# EAGLE design neopixel_studio_light (EAGLE 9.6.2)
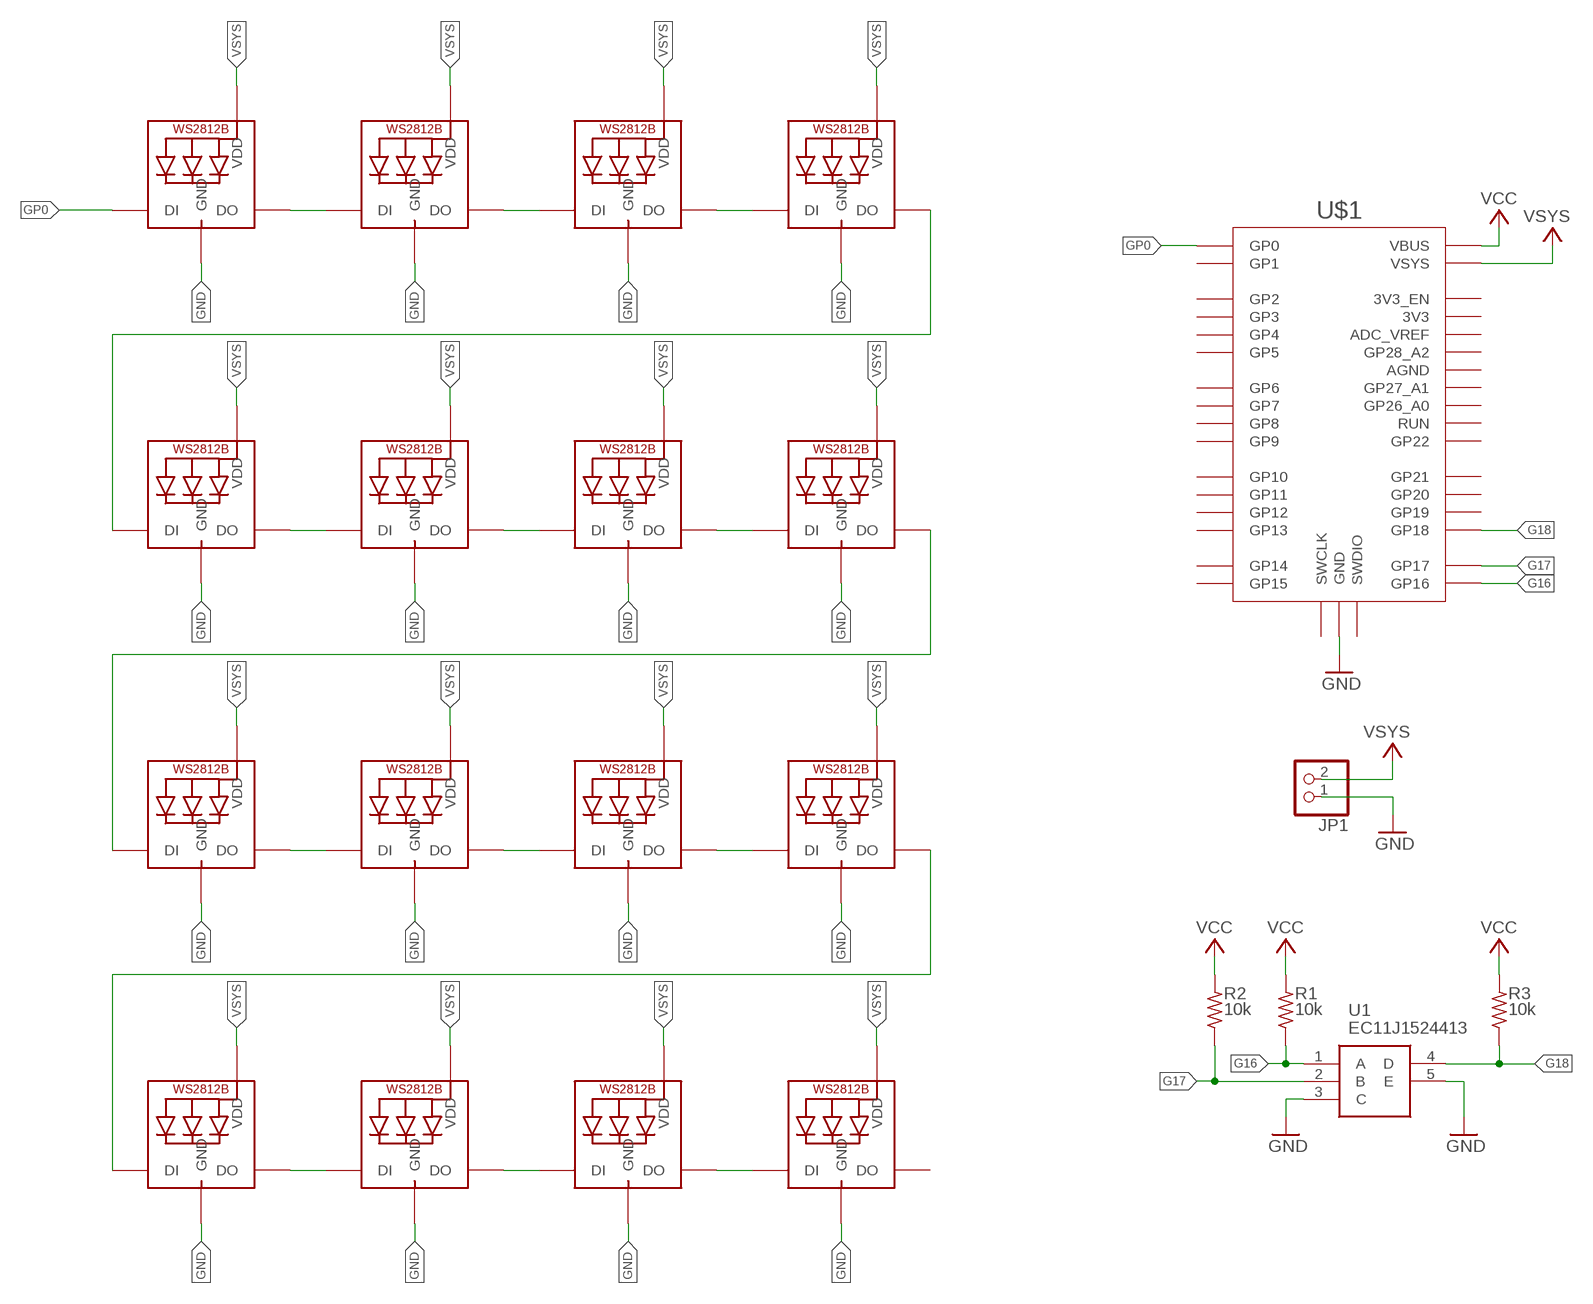
[diagram p0: schematic, sheet 1]

## Parts
JP1  PINHD-1X2  [1X02]
LED1  WS2812B5050  [WS2812B]
LED2  WS2812B5050  [WS2812B]
LED3  WS2812B5050  [WS2812B]
LED4  WS2812B5050  [WS2812B]
LED5  WS2812B5050  [WS2812B]
LED6  WS2812B5050  [WS2812B]
LED7  WS2812B5050  [WS2812B]
LED8  WS2812B5050  [WS2812B]
LED9  WS2812B5050  [WS2812B]
LED10  WS2812B5050  [WS2812B]
LED11  WS2812B5050  [WS2812B]
LED12  WS2812B5050  [WS2812B]
LED13  WS2812B5050  [WS2812B]
LED14  WS2812B5050  [WS2812B]
LED15  WS2812B5050  [WS2812B]
LED16  WS2812B5050  [WS2812B]
R1  10k  R-US_R0603  [R0603]
R2  10k  R-US_R0603  [R0603]
R3  10k  R-US_R0603  [R0603]
U1  EC11J1524413  [EC11J1524413]
U$1  RPI_PICO-SMD  [RPI_PICO]

## Nets
G16: R1.1 U1.1(A) U$1.GP16
G17: R2.1 U1.2(B) U$1.GP17
G18: R3.1 U1.4(D) U$1.GP18
GND [5V]: JP1.1 LED1.3-GND(GND) LED2.3-GND(GND) LED3.3-GND(GND) LED4.3-GND(GND) LED5.3-GND(GND) LED6.3-GND(GND) LED7.3-GND(GND) LED8.3-GND(GND) LED9.3-GND(GND) LED10.3-GND(GND) LED11.3-GND(GND) LED12.3-GND(GND) LED13.3-GND(GND) LED14.3-GND(GND) LED15.3-GND(GND) LED16.3-GND(GND) U1.3(C) U1.5(E) U$1.GND@1(GND) U$1.GND@2(GND) U$1.GND@3(GND) U$1.GND@4(GND) U$1.GND@5(GND) U$1.GND@6(GND) U$1.GND@7(GND) U$1.GND@8(GND)
GP0: LED1.4-DIN(DI) U$1.GP0
N$3: LED1.2-DOUT(DO) LED2.4-DIN(DI)
N$4: LED2.2-DOUT(DO) LED3.4-DIN(DI)
N$5: LED3.2-DOUT(DO) LED4.4-DIN(DI)
N$6: LED4.2-DOUT(DO) LED5.4-DIN(DI)
N$7: LED5.2-DOUT(DO) LED6.4-DIN(DI)
N$8: LED6.2-DOUT(DO) LED7.4-DIN(DI)
N$9: LED7.2-DOUT(DO) LED8.4-DIN(DI)
N$10: LED8.2-DOUT(DO) LED9.4-DIN(DI)
N$11: LED12.2-DOUT(DO) LED13.4-DIN(DI)
N$12: LED13.2-DOUT(DO) LED14.4-DIN(DI)
N$13: LED14.2-DOUT(DO) LED15.4-DIN(DI)
N$14: LED15.2-DOUT(DO) LED16.4-DIN(DI)
N$16: LED9.2-DOUT(DO) LED10.4-DIN(DI)
N$21: LED10.2-DOUT(DO) LED11.4-DIN(DI)
N$22: LED11.2-DOUT(DO) LED12.4-DIN(DI)
VCC [5V]: R1.2 R2.2 R3.2 U$1.VBUS
VSYS [5V]: JP1.2 LED1.1-VDD(VDD) LED2.1-VDD(VDD) LED3.1-VDD(VDD) LED4.1-VDD(VDD) LED5.1-VDD(VDD) LED6.1-VDD(VDD) LED7.1-VDD(VDD) LED8.1-VDD(VDD) LED9.1-VDD(VDD) LED10.1-VDD(VDD) LED11.1-VDD(VDD) LED12.1-VDD(VDD) LED13.1-VDD(VDD) LED14.1-VDD(VDD) LED15.1-VDD(VDD) LED16.1-VDD(VDD) U$1.VSYS
Unconnected: LED16.2-DOUT(DO) U$1.3V3 U$1.3V3_EN U$1.ADC_VREF U$1.AGND U$1.GP1 U$1.GP2 U$1.GP3 U$1.GP4 U$1.GP5 U$1.GP6 U$1.GP7 U$1.GP8 U$1.GP9 U$1.GP10 U$1.GP11 U$1.GP12 U$1.GP13 U$1.GP14 U$1.GP15 U$1.GP19 U$1.GP20 U$1.GP21 U$1.GP22 U$1.GP26_A0 U$1.GP27_A1 U$1.GP28_A2 U$1.RUN U$1.SWCLK U$1.SWDIO

## Library data of the parts
JP1 = pinhead2:PINHD-1X2: PIN HEADER
LED1-LED16 = adafruit:WS2812B
R1-R3 = rcl:R-US_: RESISTOR, American symbol; SPICEPREFIX: R
U1 = EC11J1524413:EC11J1524413: 20mm Vertical encoder 15 Pulses 30 DET Alps 15 Pulse Incremental Mechanical Rotary Encoder with a 5.975 mm Flat Shaft (Not Indexed), SMD Source: Datasheet; DESCRIPTION: 20mm Vertical encoder 15 Pulses 30 DET Alps 15 Pulse Incremental Mechanical Rotary Encoder with a 5.975 mm Flat Shaft (Not Indexed), SMD; HEIGHT: mm; MANUFACTURER_NAME: ALPS; MANUFACTURER_PART_NUMBER: EC11J1524413
U$1 = RaspberryPi_Pico:RPI_PICO

## Net classes
0 default: width 0.5 mm
1 5V: width 0.75 mm

## Board
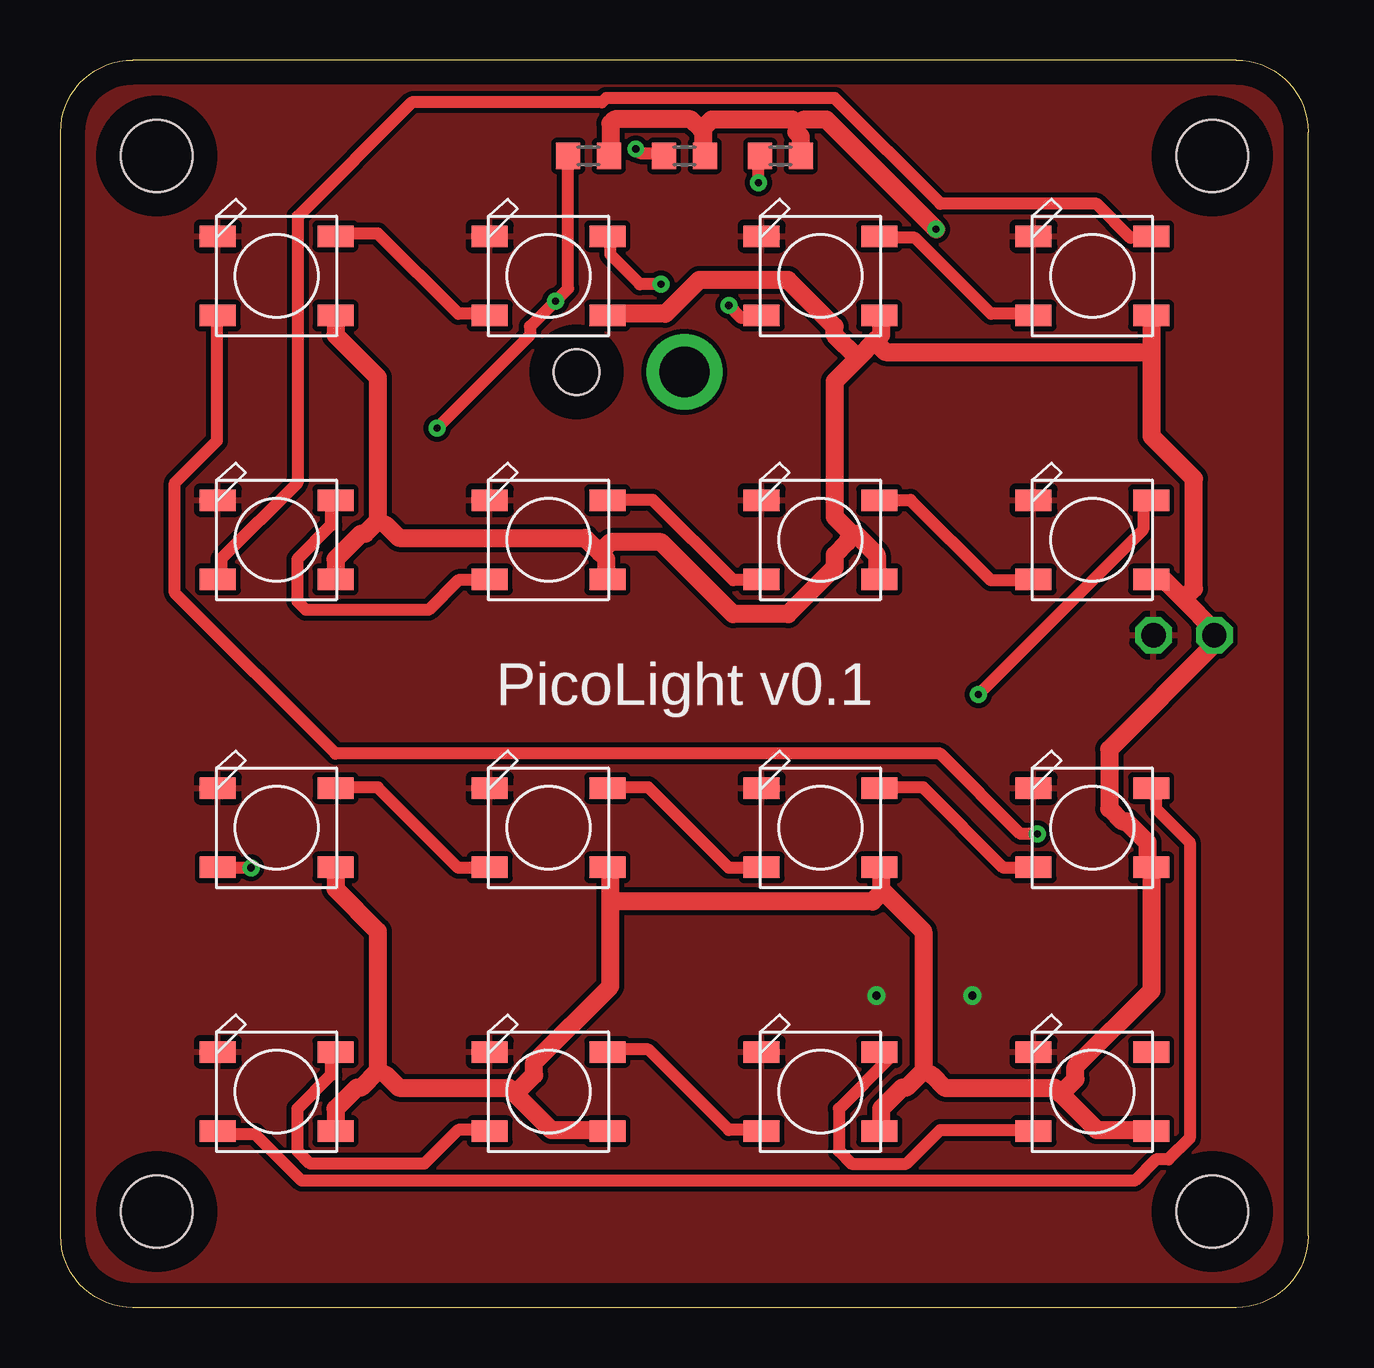
[diagram p1: board, top side]
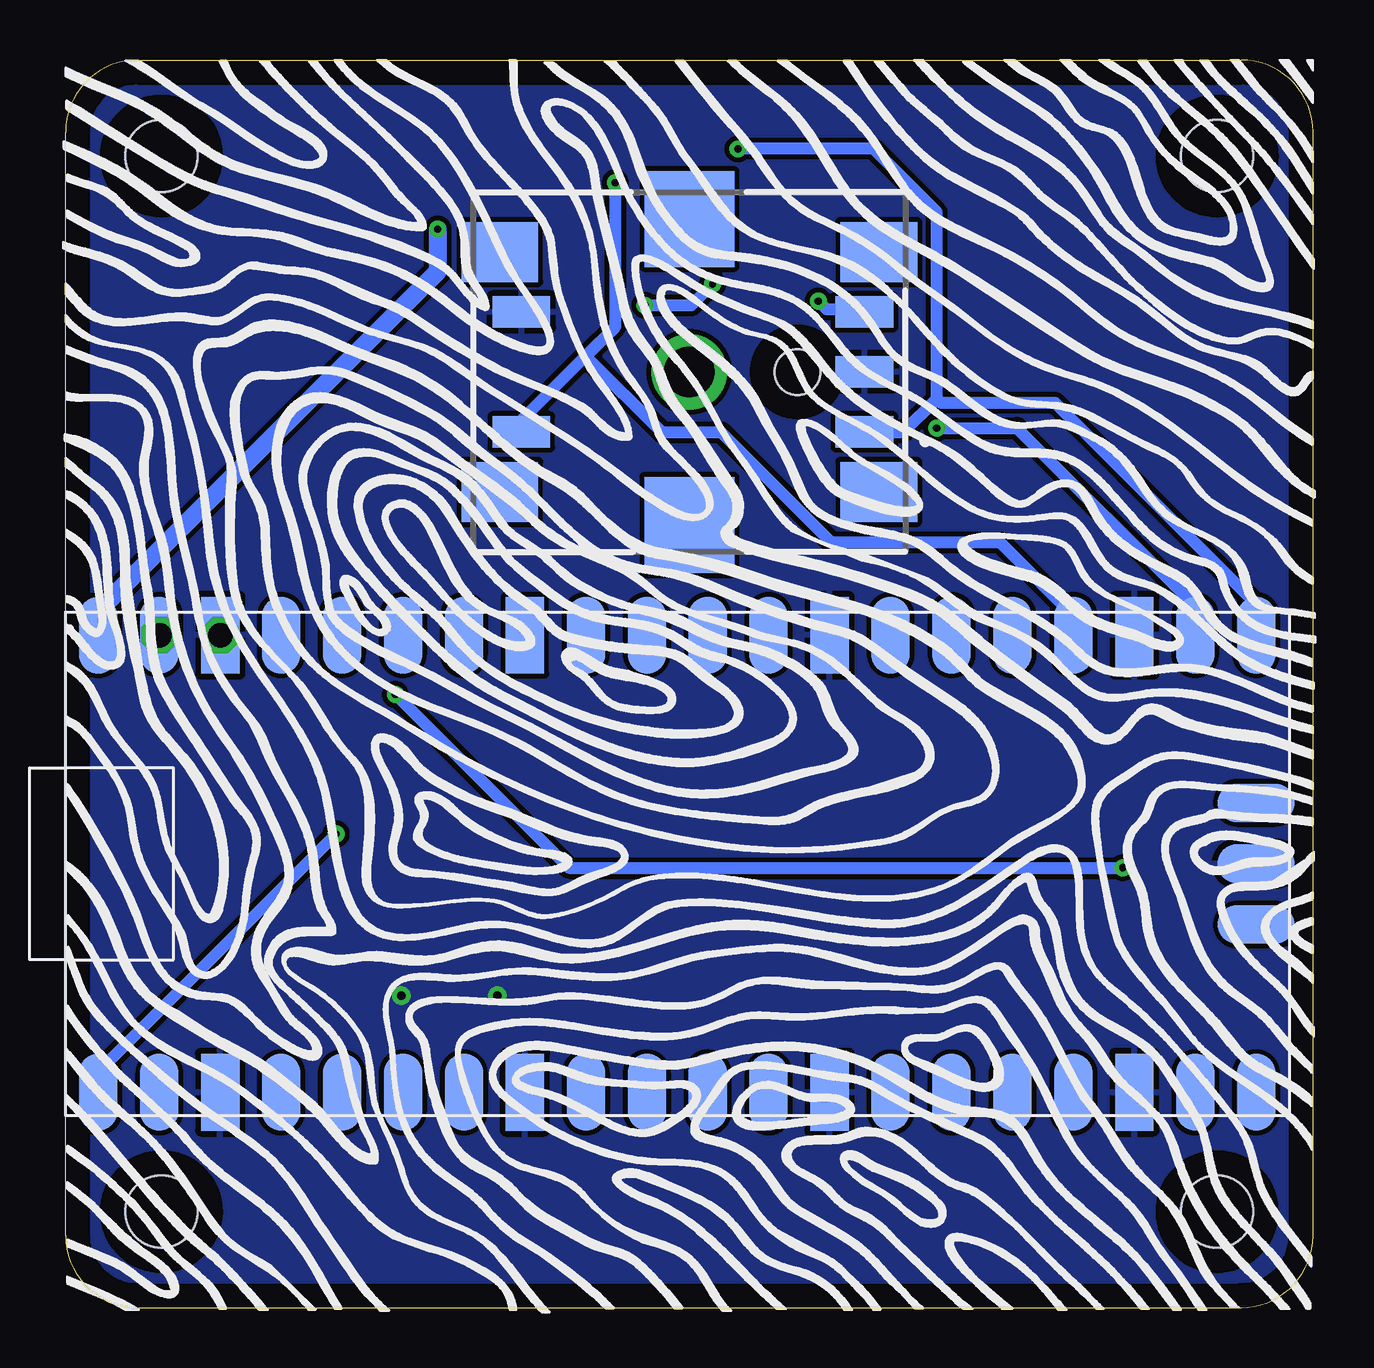
[diagram p2: board, bottom side, seen from below]

Size 52 x 52 mm. Coordinates in mm from the lower left corner, seen from the top.
Outline: 49,0 3,0 arc-90 0,3 0,49 arc-90 3,52 49,52 arc-90 52,49 52,3 arc-90 49,0
Copper layers (1*16): Top 0.035mm / dielectric 1.5mm / Bottom 0.035mm
Design rules "PCBway": minimum track width 6mil, minimum drill 0.3mm, track to track 0.205mm, track to pad 0.205mm, pad to pad 0.205mm, via to via 0.205mm, smd to smd 8mil, copper to edge 40mil, drill to drill 8mil, minimum pad ring 10mil, minimum via ring 8mil, stop-mask expansion 4mil, vias tented up to drill 25mil, thermal gap 10mil
Holes 3 mm at 4,4 4,48 48,48 48,4
bRestrict: area 1.5,45.5 to 6.5,50.5; area 45.5,45.5 to 50.5,50.5; area 45.5,1.5 to 50.5,6.5; area 1.5,1.5 to 6.5,6.5

### Footprints (pad centres in the part's own frame; a part is rotated, then mirrored left to right if it is on the bottom)
1X02 = drill 1.016 octagon: 1 -1.27,0; 2 1.27,0
WS2812B = smd 1.5 x 0.9: 1-VDD 2.45,-1.65; 2-DOUT 2.45,1.65; 3-GND -2.45,1.65; 4-DIN -2.45,-1.65
R0603 = smd 1 x 1.1: 1 -0.85,0; 2 0.85,0
EC11J1524413 = smd 1.3 x 2.4: 1 -2.5,-7.3; 2 2.5,-7.3; 3 0,-7.3; 4 -2.5,7; 5 2.5,7 | smd 2.5 x 3.2: 6 5,7.9; 8 5,-7.9; 9 -5,-7.9; 11 -5,7.9 | smd 4 x 3.75: 7 6.375,0; 10 -6.375,0 | drill 2.1 pad 3.15: 12 0,0 | hole 1.9: 0,-4.5
RPI_PICO = smd 3.2 x 1.6: 3V3 9.525,13.97; 3V3_EN 9.525,16.51; ADC_VREF 9.525,11.43; AGND 9.525,6.35; GND@1 -9.525,19.05; GND@2 -9.525,6.35; GND@3 -9.525,-6.35; GND@4 -9.525,-19.05; GND@6 9.525,-19.05; GND@7 9.525,-6.35; GND@8 9.525,19.05; GP0 -9.525,24.13; GP1 -9.525,21.59; GP2 -9.525,16.51; GP3 -9.525,13.97; GP4 -9.525,11.43; GP5 -9.525,8.89; GP6 -9.525,3.81; GP7 -9.525,1.27; GP8 -9.525,-1.27; GP9 -9.525,-3.81; GP10 -9.525,-8.89; GP11 -9.525,-11.43; GP12 -9.525,-13.97; GP13 -9.525,-16.51; GP14 -9.525,-21.59; GP15 -9.525,-24.13; GP16 9.525,-24.13; GP17 9.525,-21.59; GP18 9.525,-16.51; GP19 9.525,-13.97; GP20 9.525,-11.43; GP21 9.525,-8.89; GP22 9.525,-3.81; GP26_A0 9.525,1.27; GP27_A1 9.525,3.81; GP28_A2 9.525,8.89; RUN 9.525,-1.27; VBUS 9.525,24.13; VSYS 9.525,21.59 | smd 1.6 x 3.2: GND@5 0,-24.13; SWCLK -2.54,-24.13; SWDIO 2.54,-24.13

### Placement (x,y rotation side)
JP1  46.82,28.03 0 top
LED1  9,43 0 top
LED2  20.33,43 0 top
LED3  31.67,43 0 top
LED4  43,43 0 top
LED5  9,32 0 top
LED6  20.33,32 0 top
LED7  31.67,32 0 top
LED8  43,32 0 top
LED9  9,20 0 top
LED10  20.33,20 0 top
LED11  31.67,20 0 top
LED12  43,20 0 top
LED13  9,9 0 top
LED14  20.33,9 0 top
LED15  31.67,9 0 top
LED16  43,9 0 top
R1  26,48 0 top
R2  22,48 0 top
R3  30,48 0 top
U1  26,39 90 bottom
U$1  26.5,18.5 90 bottom

### Tracks (layer width: path | path; a pad name or v marks a point on that pad's centre or on a via)
G16  (via drill 0.3)
  Top 0.5: v23.97,48.29 24.15,48.12 25.03,48.12 R1.1
  Bottom 0.5: v23.97,48.29 18.33,48.29 15.69,45.65 15.69,37.89 | 15.69,37.89 17.1,36.48 18.68,36.48 U1.1 | U$1.GP16 2.47,28.2 2.47,29.43 10.75,37.72 15.51,37.72 15.69,37.89
G17  (via drill 0.3)
  Top 0.5: R2.1 21.15,42.48 v20.62,41.95 19.56,40.89 19.56,40.54 v15.69,36.66
  Bottom 0.5: v20.62,41.95 20.27,41.59 18.86,41.59 U1.2 | v15.69,36.66 12.34,36.66 4.93,29.26 4.93,28.2 U$1.GP17
G18  (via drill 0.3)
  Top 0.5: v29.08,46.88 29.08,47.94 R3.1
  Bottom 0.5: v29.08,46.88 29.08,40.89 30.32,39.66 | 30.32,39.66 32.96,37.01 32.96,36.66 U1.4 | 30.32,39.66 27.14,36.48 24.68,36.48 20.09,31.9 13.04,31.9 10.05,28.91 10.05,28.2 U$1.GP18
GND  (via drill 0.35)
  other vias: 34,13 38,13
  pour Top: 0,0 52,0 52,0.5 52,52 0,52
  pour Bottom: 0,0 52,0 52,52 0,52
GP0  (via drill 0.3)
  Top 0.5: v40.71,19.74 40.01,19.74 36.66,23.09 11.46,23.09 4.76,29.79 4.76,34.37 6.52,36.13 6.52,41.24 LED1.4-DIN
  Bottom 0.5: v40.71,19.74 50.58,9.87 50.58,8.99 U$1.GP0
N$3
  Top 0.5: LED1.2-DOUT 11.46,44.77 13.22,44.77 16.57,41.42 17.8,41.42 LED2.4-DIN
N$4  (via drill 0.3)
  Top 0.5: v25.03,42.65 24.15,42.65 22.91,43.89 22.91,44.59 LED2.2-DOUT | v27.85,41.77 28.38,41.24 29.08,41.24 LED3.4-DIN
  Bottom 0.5: v25.03,42.65 25.91,41.77 v27.85,41.77
N$5
  Top 0.5: LED3.2-DOUT 34.19,44.59 35.6,44.59 38.77,41.42 40.54,41.42 LED4.4-DIN
N$6
  Top 0.5: LED5.4-DIN 6.7,30.49 6.7,31.2 9.87,34.37 9.87,45.47 14.63,50.23 22.56,50.23 22.74,50.41 32.25,50.41 36.66,46 43.18,46 44.59,44.59 45.3,44.59 LED4.2-DOUT
N$7
  Top 0.5: LED5.2-DOUT 11.28,33.49 11.28,32.61 9.87,31.2 9.87,29.43 10.22,29.08 15.33,29.08 16.57,30.32 17.8,30.32 LED6.4-DIN
N$8
  Top 0.5: LED6.2-DOUT 22.91,33.66 24.68,33.66 28.02,30.32 29.08,30.32 LED7.4-DIN
N$9
  Top 0.5: LED8.4-DIN 40.54,30.32 38.77,30.32 35.43,33.66 34.19,33.66 LED7.2-DOUT
N$10  (via drill 0.3)
  Top 0.5: v7.93,18.33 6.7,18.33 LED9.4-DIN | v38.25,25.56 45.12,32.43 45.12,33.49 45.3,33.66 LED8.2-DOUT
  Bottom 0.5: v7.93,18.33 31.02,18.33 v38.25,25.56
N$11
  Top 0.5: LED13.4-DIN 6.7,7.23 8.11,7.23 10.05,5.29 44.77,5.29 45.65,6.17 46.18,6.17 47.06,7.05 47.06,19.39 45.65,20.8 45.65,21.5 45.47,21.68 LED12.2-DOUT
N$12
  Top 0.5: LED13.2-DOUT 11.28,10.57 11.28,9.69 9.87,8.28 9.87,6.52 10.4,5.99 15.16,5.99 16.57,7.4 17.8,7.4 LED14.4-DIN
N$13
  Top 0.5: LED14.2-DOUT 22.91,10.75 24.5,10.75 27.85,7.4 29.08,7.4 LED15.4-DIN
N$14
  Top 0.5: LED16.4-DIN 40.54,7.4 36.66,7.4 35.25,5.99 32.96,5.99 32.43,6.52 32.43,8.28 34.55,10.4 34.19,10.75 LED15.2-DOUT
N$16
  Top 0.5: LED9.2-DOUT 11.46,21.68 13.22,21.68 16.57,18.33 17.8,18.33 LED10.4-DIN
N$21
  Top 0.5: LED10.2-DOUT 22.91,21.68 24.5,21.68 27.85,18.33 29.08,18.33 LED11.4-DIN
N$22
  Top 0.5: LED11.2-DOUT 34.19,21.68 35.95,21.68 39.3,18.33 40.54,18.33 LED12.4-DIN
VCC  (via drill 0.3)
  Top 0.75: 26.7,49.09 26.79,49 26.79,48.12 R1.2 | 26.7,49.09 26.26,49.53 23.09,49.53 22.91,49.35 22.91,48.12 R2.2 | 30.67,49.35 30.67,49 30.84,48.82 30.84,48.12 R3.2 | 30.67,49.35 30.49,49.53 27.14,49.53 26.7,49.09 | v36.48,44.94 31.9,49.53 31.02,49.53 30.67,49.35
  Bottom 0.75: v36.48,44.94 36.48,43.18 50.58,29.08 50.58,28.2 U$1.VBUS
VSYS
  Top 0.75: 13.22,9.87 12.51,9.16 12.34,9.16 11.46,8.28 11.46,7.4 LED13.1-VDD | 13.22,9.87 13.22,15.69 11.46,17.45 11.46,18.33 LED9.1-VDD | 18.95,8.9 18.68,9.16 14.1,9.16 13.57,9.69 13.22,9.87 | 18.95,8.9 20.45,7.4 22.74,7.4 LED14.1-VDD | 22.91,16.92 22.91,13.39 19.74,10.22 19.74,9.69 18.95,8.9 | 22.91,16.92 22.91,18.33 LED10.1-VDD | 35.95,9.87 35.25,9.16 35.07,9.16 34.19,8.28 34.19,7.4 LED15.1-VDD | 35.95,9.87 35.95,15.69 34.28,17.36 | 34.28,17.36 34.19,17.45 34.19,18.33 LED11.1-VDD | 41.68,8.9 41.42,9.16 36.84,9.16 36.31,9.69 35.95,9.87 | 41.68,8.9 43.18,7.4 45.3,7.4 LED16.1-VDD | 41.68,8.9 42.3,9.52 42.3,10.05 45.47,13.22 45.47,18.33 LED12.1-VDD 45.3,18.68 45.3,19.39 44.41,20.27 44.24,20.27 43.71,20.8 43.71,23.27 48.12,27.67 U$1.VSYS 48.12,28.2 46.79,29.52 | 22.91,16.92 33.84,16.92 34.28,17.36 | 13.22,32.78 12.69,32.25 12.51,32.25 11.46,31.2 11.46,30.49 LED5.1-VDD | 13.22,32.78 13.22,38.77 11.46,40.54 11.46,41.24 LED1.1-VDD | 22.47,31.46 21.86,32.08 14.1,32.08 13.57,32.61 13.22,32.78 | 22.47,31.46 22.74,31.2 22.74,30.49 LED6.1-VDD | 46.79,29.52 46,30.32 45.47,30.32 LED8.1-VDD | 45.47,39.83 45.47,36.31 47.23,34.55 47.23,29.96 46.79,29.52 | 45.47,39.83 45.47,41.24 LED4.1-VDD | 32.96,32.25 33.13,32.25 34.02,31.37 34.02,30.49 LED7.1-VDD | 32.96,32.25 32.25,32.96 32.25,38.6 33.22,39.57 | 33.93,40.27 34.19,40.54 34.19,41.24 LED3.1-VDD | 33.93,40.27 33.22,39.57 | 33.22,39.57 32.25,40.54 32.25,40.89 30.32,42.83 26.61,42.83 25.2,41.42 22.91,41.42 LED2.1-VDD | 45.47,39.83 34.37,39.83 33.93,40.27 | 22.47,31.46 22.91,31.9 25.03,31.9 28.02,28.91 30.32,28.91 32.25,30.84 32.25,31.37 32.78,31.9 32.96,32.25
  Bottom 0.75: U$1.VSYS 48.12,28.02 U$1.VSYS

### Text on the board
tPlace: PicoLight v0.1